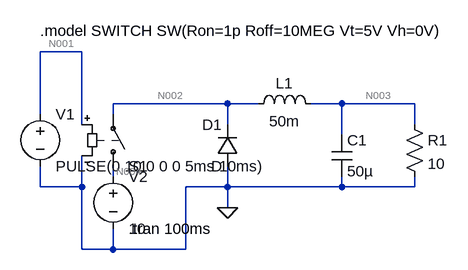
[diagram p0: schematic rlc_switching_tester.asc]
rlc_switching_tester.asc, the LTspice schematic file:
Version 4
SHEET 1 880 680
WIRE -48 -32 -112 -32
WIRE 176 48 0 48
WIRE 224 48 176 48
WIRE 352 48 304 48
WIRE 464 48 352 48
WIRE -112 64 -112 -32
WIRE 0 64 0 48
WIRE -48 80 -48 -32
WIRE 176 80 176 48
WIRE 464 80 464 48
WIRE 352 96 352 48
WIRE 0 160 0 144
WIRE -112 176 -112 144
WIRE -48 176 -48 128
WIRE -48 176 -112 176
WIRE 176 176 176 144
WIRE 176 176 112 176
WIRE 352 176 352 160
WIRE 352 176 176 176
WIRE 464 176 464 160
WIRE 464 176 352 176
WIRE 176 208 176 176
WIRE -48 272 -48 176
WIRE 0 272 0 240
WIRE 0 272 -48 272
WIRE 112 272 112 176
WIRE 112 272 0 272
FLAG 176 208 0
SYMBOL cap 336 96 R0
SYMATTR InstName C1
SYMATTR Value 50µ
SYMBOL ind 208 64 R270
WINDOW 0 32 56 VTop 2
WINDOW 3 5 56 VBottom 2
SYMATTR InstName L1
SYMATTR Value 50m
SYMBOL res 448 64 R0
SYMATTR InstName R1
SYMATTR Value 10
SYMBOL diode 192 144 R180
WINDOW 0 24 64 Left 2
WINDOW 3 24 0 Left 2
SYMATTR InstName D1
SYMBOL voltage -112 48 R0
WINDOW 123 0 0 Left 2
WINDOW 39 0 0 Left 2
SYMATTR InstName V1
SYMATTR Value PULSE(0 10 0 0 0 5ms 10ms)
SYMBOL sw 0 160 M180
SYMATTR InstName S1
SYMATTR Value ""
SYMATTR SpiceModel SWITCH
SYMBOL voltage 0 144 R0
WINDOW 123 0 0 Left 2
WINDOW 39 0 0 Left 2
SYMATTR InstName V2
SYMATTR Value 10
TEXT 24 240 Left 2 !.tran 100ms
TEXT -112 -64 Left 2 !.model SWITCH SW(Ron=1p Roff=10MEG Vt=5V Vh=0V)

The netlist it stands for:
* rlc_switching_tester.asc
C1 N003 0 50µ
L1 N002 N003 50m
R1 N003 0 10
D1 0 N002 D
V1 N001 0 PULSE(0 10 0 0 0 5ms 10ms)
S1 N004 N002 N001 0 SWITCH
V2 N004 0 10
.model D D
.lib standard.dio
.tran 100ms
.model SWITCH SW(Ron=1p Roff=10MEG Vt=5V Vh=0V)
.backanno
.end

* Results of the author's LTspice run, read from the files saved beside the schematic
* Operating Point, zero values left out:
*   V(n003) = 10 µV
*   V(n002) = 10 µV
*   V(n004) = 10 V
*   I(L1) = 1 µA
*   I(R1) = 1 µA
*   I(S1) = -1 µA
*   I(V2) = -1 µA
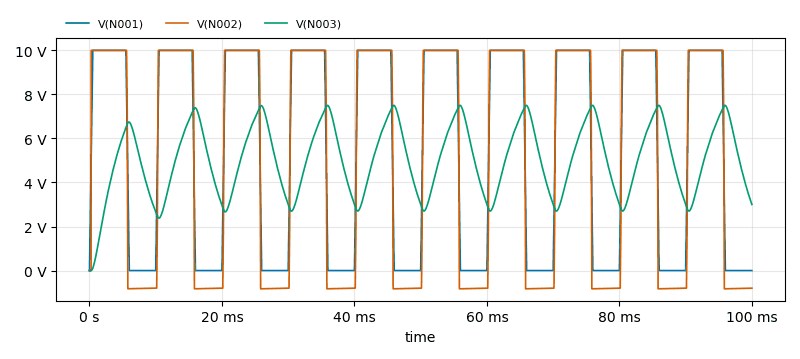
[diagram p1: Transient Analysis of rlc_switching_tester.asc, plotted from the saved traces]
* Transient Analysis, 1 run:
*   V(N001): min 0 V, max 10 V, average 5.5 V, rms 7.308 V, last 0 V
*   V(N002): min -827 mV, max 10 V, average 5.135 V, rms 7.396 V, last -798.7 mV
*   V(N003): min 10 µV, max 7.503 V, average 5.026 V, rms 5.286 V, last 3.004 V